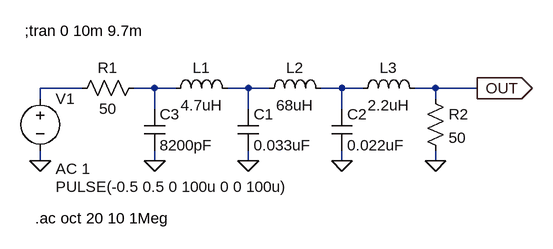
[diagram p0: schematic PCM5102A_FG_RLC_4thLPF.asc]
PCM5102A_FG_RLC_4thLPF.asc, the LTspice schematic file:
Version 4
SHEET 1 880 680
WIRE 64 112 0 112
WIRE 176 112 144 112
WIRE 208 112 176 112
WIRE 320 112 288 112
WIRE 352 112 320 112
WIRE 464 112 432 112
WIRE 496 112 464 112
WIRE 608 112 576 112
WIRE 672 112 608 112
WIRE 0 128 0 112
WIRE 608 128 608 112
WIRE 176 144 176 112
WIRE 320 144 320 112
WIRE 464 144 464 112
WIRE 0 224 0 208
WIRE 176 224 176 208
WIRE 320 224 320 208
WIRE 464 224 464 208
WIRE 608 224 608 208
FLAG 176 224 0
FLAG 320 224 0
FLAG 464 224 0
FLAG 0 224 0
FLAG 672 112 OUT
IOPIN 672 112 Out
FLAG 608 224 0
SYMBOL ind 192 128 R270
WINDOW 0 32 56 VTop 2
WINDOW 3 5 56 VBottom 2
SYMATTR InstName L1
SYMATTR Value 4.7uH
SYMBOL ind 336 128 R270
WINDOW 0 32 56 VTop 2
WINDOW 3 5 56 VBottom 2
SYMATTR InstName L2
SYMATTR Value 68uH
SYMBOL ind 480 128 R270
WINDOW 0 32 56 VTop 2
WINDOW 3 5 56 VBottom 2
SYMATTR InstName L3
SYMATTR Value 2.2uH
SYMBOL cap 304 144 R0
SYMATTR InstName C1
SYMATTR Value 0.033uF
SYMBOL cap 448 144 R0
SYMATTR InstName C2
SYMATTR Value 0.022uF
SYMBOL cap 160 144 R0
SYMATTR InstName C3
SYMATTR Value 8200pF
SYMBOL voltage 0 112 R0
WINDOW 3 24 152 Left 2
WINDOW 123 24 124 Left 2
WINDOW 39 0 0 Left 2
SYMATTR Value PULSE(-0.5 0.5 0 100u 0 0 100u)
SYMATTR Value2 AC 1
SYMATTR InstName V1
SYMBOL res 160 96 R90
WINDOW 0 0 56 VBottom 2
WINDOW 3 32 56 VTop 2
SYMATTR InstName R1
SYMATTR Value 50
SYMBOL res 592 112 R0
SYMATTR InstName R2
SYMATTR Value 50
TEXT -8 312 Left 2 !.ac oct 20 10 1Meg
TEXT -24 24 Left 2 !;tran 0 10m 9.7m

The netlist it stands for:
* PCM5102A_FG_RLC_4thLPF.asc
L1 N002 N003 4.7uH
L2 N003 N004 68uH
L3 N004 OUT 2.2uH
C1 N003 0 0.033uF
C2 N004 0 0.022uF
C3 N002 0 8200pF
V1 N001 0 PULSE(-0.5 0.5 0 100u 0 0 100u) AC 1
R1 N002 N001 50
R2 OUT 0 50
.ac oct 20 10 1Meg
;tran 0 10m 9.7m
.backanno
.end